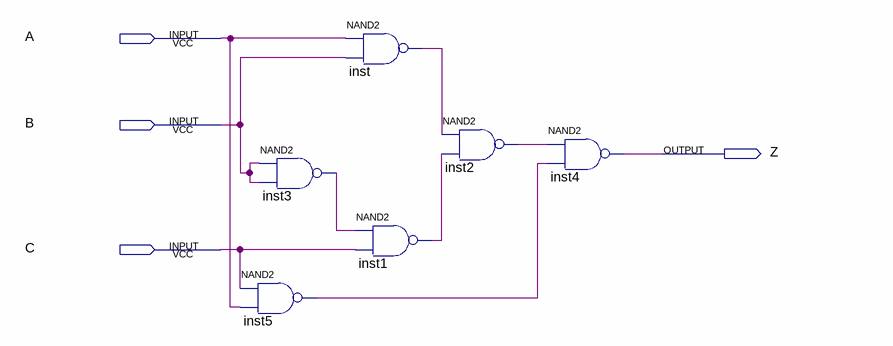
[diagram p0: schematic sheet]
// Quartus schematic rudundant_term.bdf as structural Verilog: 6 symbols, 4 pins
module rudundant_term (
  input  A,
  input  B,
  input  C,
  output Z
);

  wire inst1_out, inst2_out, inst3_out, inst5_out, inst_out;

  nand inst5 (inst5_out, C, A);
  nand inst3 (inst3_out, B, B);
  nand inst (inst_out, A, B);
  nand inst1 (inst1_out, inst3_out, C);
  nand inst2 (inst2_out, inst_out, inst1_out);
  nand inst4 (Z, inst2_out, inst5_out);
endmodule
